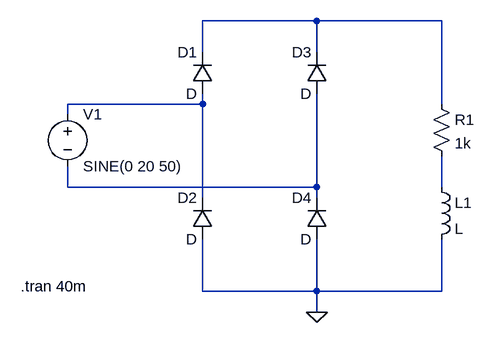
[diagram p0: schematic FullWaveRectInduc.asc]
FullWaveRectInduc.asc, the LTspice schematic file:
Version 4
SHEET 1 880 680
WIRE 528 144 352 144
WIRE 720 144 528 144
WIRE 352 192 352 144
WIRE 528 192 528 144
WIRE 352 272 352 256
WIRE 352 272 144 272
WIRE 720 272 720 144
WIRE 144 288 144 272
WIRE 144 400 144 368
WIRE 528 400 528 256
WIRE 528 400 144 400
WIRE 720 400 720 352
WIRE 352 416 352 272
WIRE 528 416 528 400
WIRE 352 560 352 480
WIRE 528 560 528 480
WIRE 528 560 352 560
WIRE 720 560 720 480
WIRE 720 560 528 560
WIRE 528 592 528 560
FLAG 528 592 0
SYMBOL voltage 144 272 R0
SYMATTR InstName V1
SYMATTR Value SINE(0 20 50)
SYMBOL diode 368 256 R180
WINDOW 0 24 64 Left 2
WINDOW 3 24 0 Left 2
SYMATTR InstName D1
SYMBOL diode 368 480 R180
WINDOW 0 24 64 Left 2
WINDOW 3 24 0 Left 2
SYMATTR InstName D2
SYMBOL diode 544 256 R180
WINDOW 0 24 64 Left 2
WINDOW 3 24 0 Left 2
SYMATTR InstName D3
SYMBOL diode 544 480 R180
WINDOW 0 24 64 Left 2
WINDOW 3 24 0 Left 2
SYMATTR InstName D4
SYMBOL res 704 256 R0
SYMATTR InstName R1
SYMATTR Value 1k
SYMBOL ind 704 384 R0
SYMATTR InstName L1
TEXT 72 552 Left 2 !.tran 40m

The netlist it stands for:
* FullWaveRectInduc.asc
V1 N002 N003 SINE(0 20 50)
D1 N002 N001 D
D2 0 N002 D
D3 N003 N001 D
D4 0 N003 D
R1 N001 N004 1k
L1 N004 0 L
.model D D
.lib standard.dio
.tran 40m
.backanno
.end